# EAGLE design Blink_Schematic_v2 (EAGLE 9.1.3)
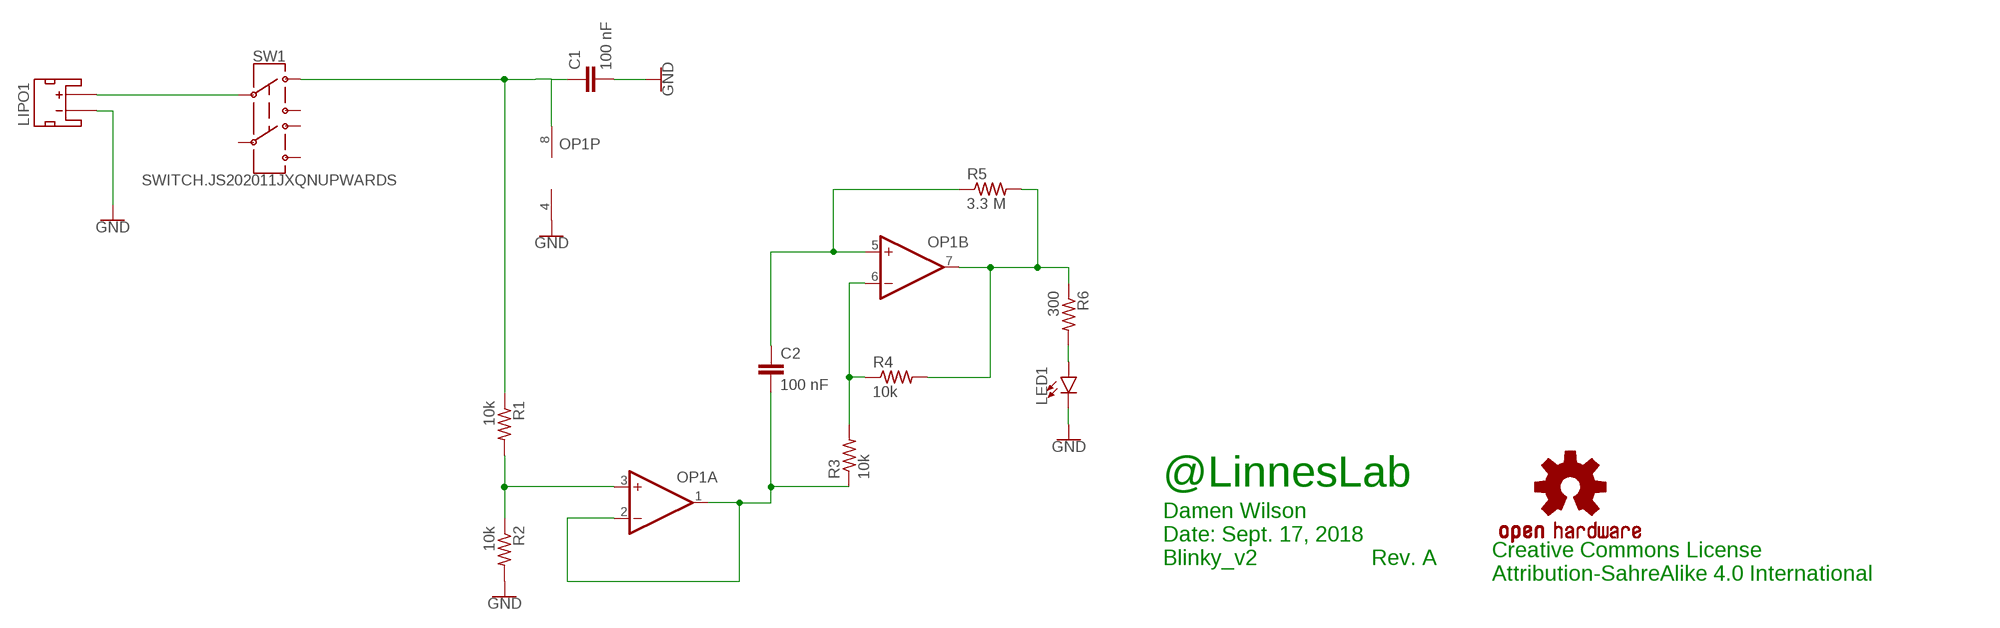
[diagram p0: schematic, sheet 1]

## Parts
C1  100 nF  C-EUC0402  [C0402]
C2  100 nF  C-EUC0402  [C0402]
LED1  LED0603  [LED-0603]
LIPO1  JST_2MM_MALE  [JST-2-SMD]
LOGO1  OSHW-LOGOL  [OSHW-LOGO-L]
OP1  OP-DUALRM  [MSOP08]
R1  10k  R-US_R0402  [R0402]
R2  10k  R-US_R0402  [R0402]
R3  10k  R-US_R0402  [R0402]
R4  10k  R-US_R0402  [R0402]
R5  3.3 M  R-US_R0402  [R0402]
R6  300  R-US_R0402  [R0402]
SW1  SWITCH.JS202011JXQNUPWARDS  [SWITCH.00]

## Nets
GND: C1.2 LED1.C LIPO1.1(-) OP1.4(P:V-) R2.2
N$1: LIPO1.2(+) SW1.2
N$2: C1.1 OP1.8(P:V+) R1.1 SW1.1
N$3: OP1.3(A:+IN) R1.2 R2.1
N$4: C2.2 OP1.1(A:OUT) OP1.2(A:-IN) R3.1
N$5: C2.1 OP1.5(B:+IN) R5.1
N$6: OP1.6(B:-IN) R3.2 R4.1
N$7: OP1.7(B:OUT) R4.2 R5.2 R6.1
N$8: LED1.A R6.2
Unconnected: LIPO1.NC1(PAD1) LIPO1.NC2(PAD2) SW1.3 SW1.5 SW1.6 SW1.7

## Notes on the sheet
- @LinnesLab
- Damen Wilson
  Date: Sept. 17, 2018
  Blinky_v2                   Rev. A
- Creative Commons License
  Attribution-SahreAlike 4.0 International

## Library data of the parts
C1 C2 = rcl:C-EU: CAPACITOR, European symbol; SPICEPREFIX: C
LED1 = CalvEngIO-LED:LED: LED (Generic) Standard schematic elements and footprints for 5mm, 3mm, 1206, and 0603 sized LEDs. Generic LEDs with no color specified. LTST-C190KGKT: arrow indicates cathode
LIPO1 = CalvEngIO-Connectors:JST_2MM_MALE: JST 2MM MALE RA CONNECTOR Two pin, compact surface mount connector. Commonly used as a battery input connection point. We really like the solid locking feeling and high current rating on these small connectors. We use these all the time as battery connectors. Mates to single-cell LiPo batteries. Here is the connector we sell at SparkFun: JST Right Angle Connector - White <https://www.sparkfun.com/products/8612> (PRT-08612) Datasheet <http://www.sparkfun.com/datasheets/Prototyping/Connectors/JST-Horizontal.pdf> It was used on these SparkFun products: SparkFun MOSFET Power Controller <https://www.sparkfun.com/products/11214> (PRT-11214) SparkFun Battery Babysitter - LiPo Battery Manager <https://www.sparkfun.com/products/13777> (PRT-13777) And many, many others that required a lipo battery connection.; PROD_ID: CONN-11443; SF_ID: PRT-08612
LOGO1 = CalvEngIO-Logos:OSHW-LOGO: Open-Source Hardware (OSHW) Logo This logo indicates the piece of hardware it is found on incorporates a OSHW license and/or adheres to the definition of open source hardware found here: http://freedomdefined.org/OSHW
OP1 = CalvEngIO-AnalogIC:OP-DUAL: Precision Micropower, Low Noise CMOS, Rail-to-Rail Input/Output Operational Amplifiers Source: http://www.analog.com/static/imported-files/data_sheets/AD8603_8607_8609.pdf; MF: ALTERA CORPORATION; MPN: AD8607ARMZ-REEL; OC_FARNELL: 1464990; OC_NEWARK: 59K6925
R1-R6 = adafruit:R-US_: RESISTOR, American symbol
SW1 = CalvEngIO-Switches:SWITCH.JS202011JXQN: Manufacturer's Part Numer: JS202011JAQN for right angle throw JS202011JCQN for top side throw

## Board
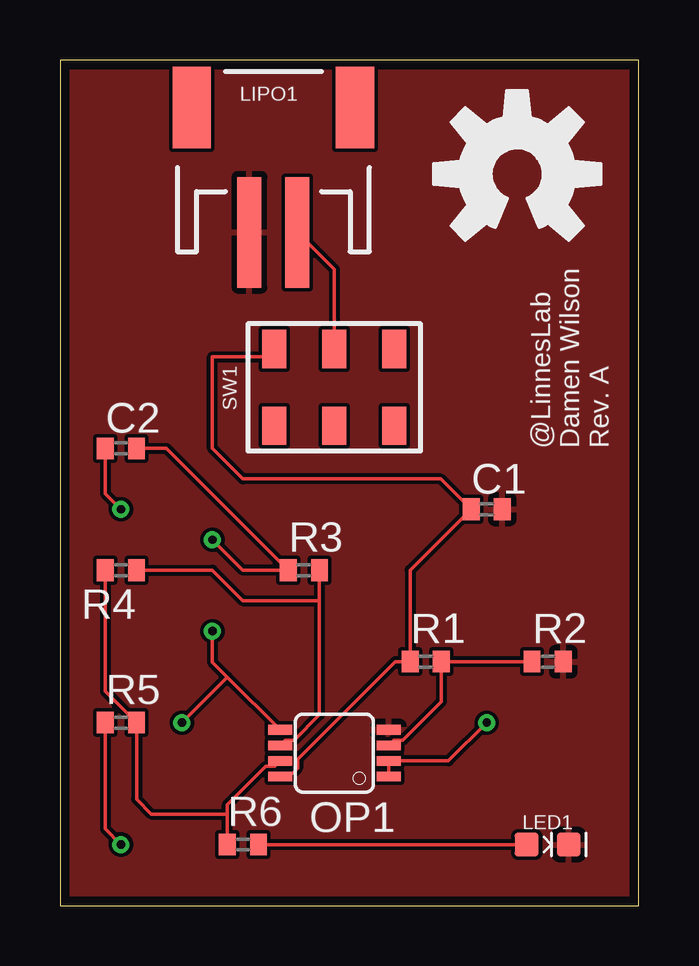
[diagram p1: board, top side]
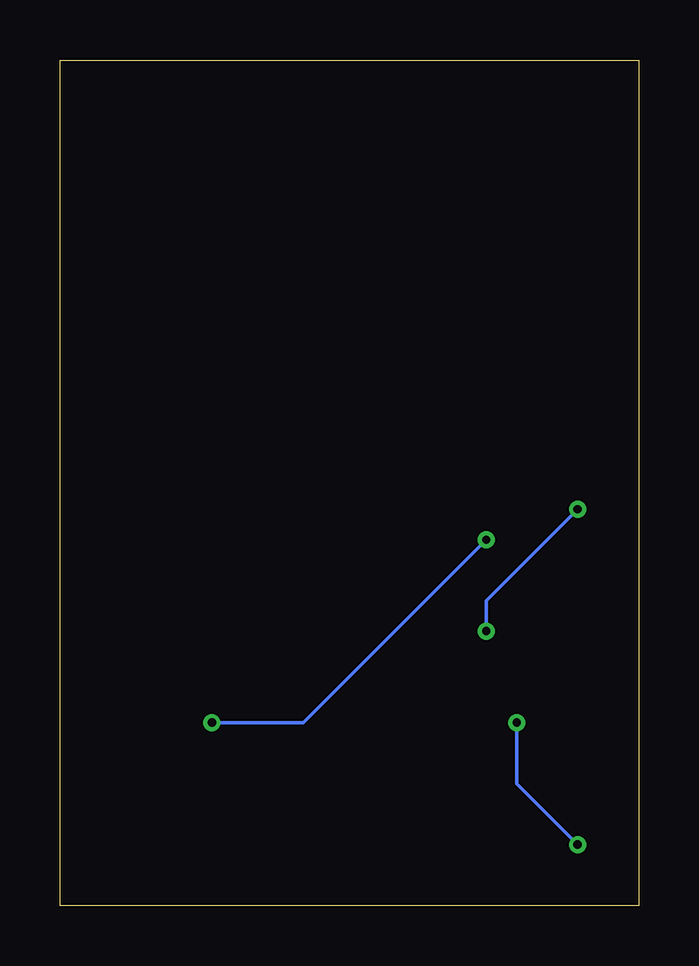
[diagram p2: board, bottom side, seen from below]

Size 24.11 x 35.23 mm. Coordinates in mm from the lower left corner, seen from the top.
Outline: 0,0 24.11,0 24.11,35.23 0,35.23 0,0
Copper layers (1*16): Top 0.0356mm / dielectric 1.5011mm / Bottom 0.0356mm
Design rules "LaenPCBOrder": minimum track width 6mil, minimum drill 13mil, track to track 6mil, track to pad 6mil, pad to pad 6mil, via to via 6mil, smd to smd 6mil, copper to edge 15mil, drill to drill 6mil, minimum pad ring 7mil, minimum via ring 7mil, stop-mask expansion 3mil, vias tented up to drill 0mil, thermal gap 10mil

### Footprints (pad centres in the part's own frame; a part is rotated, then mirrored left to right if it is on the bottom)
C0402 = smd 0.7 x 0.9: 1 -0.65,0; 2 0.65,0
LED-0603 = smd 1 x 1: A -0.877,0; C 0.877,0
JST-2-SMD = smd 1 x 4.6: 1 -1,-3.7; 2 1,-3.7 | smd 1.6 x 3.4: NC1 -3.4,1.5; NC2 3.4,1.5
MSOP08 = smd 0.4 x 1: 1 -0.976,-2.263; 2 -0.326,-2.263; 3 0.324,-2.263; 4 0.974,-2.263; 5 0.974,2.262; 6 0.324,2.262; 7 -0.326,2.262; 8 -0.976,2.262
R0402 = smd 0.7 x 0.9: 1 -0.65,0; 2 0.65,0
SWITCH.00 = smd 1 x 1.6: 1 -2.5,1.6; 2 0,1.6; 3 2.5,1.6; 5 -2.5,-1.6; 6 0,-1.6; 7 2.5,-1.6

### Placement (x,y rotation side)
C1  17.78,16.51 0 top
C2  2.54,19.05 0 top
LED1  20.32,2.54 0 top
LIPO1  8.89,31.75 0 top
LOGO1  19.05,30.48 0 top
OP1  11.43,6.35 90 top
R1  15.24,10.16 0 top
R2  20.32,10.16 0 top
R3  10.16,13.97 0 top
R4  2.54,13.97 180 top
R5  2.54,7.62 0 top
R6  7.62,2.54 0 top
SW1  11.43,21.59 0 top

### Tracks (layer width: path | path; a pad name or v marks a point on that pad's centre or on a via)
GND
  pour Top: -2.54,36.83 -2.54,-1.27 25.4,-1.27 25.4,36.83
N$1
  Top 0.152: LIPO1.2 11.43,26.51 SW1.2
N$2
  Top 0.152: OP1.8 9.54,5.37 9.9,5.73 9.9,6.09 13.97,10.16 R1.1 14.59,13.97 C1.1 15.86,17.78 7.62,17.78 6.35,19.05 6.35,22.86 8.6,22.86 SW1.1
N$3
  Top 0.152: R2.1 R1.2 15.89,8.5 14.29,6.89 13.91,6.89 OP1.3
N$4  (via drill 0.35)
  Top 0.152: C2.2 4.43,19.05 R3.1 7.62,13.97 v6.35,15.24 | v17.78,7.62 16.18,6.02 OP1.2 OP1.1
  Bottom 0.152: v6.35,15.24 13.97,7.62 v17.78,7.62
N$5  (via drill 0.35)
  Top 0.152: C2.1 1.89,17.16 v2.54,16.51 | v6.35,11.43 6.35,10.14 6.98,9.52 | 6.98,9.52 OP1.5 | R5.1 1.89,3.19 v2.54,2.54 | v5.08,7.62 6.98,9.52
  Bottom 0.152: v2.54,16.51 6.35,12.7 v6.35,11.43 | v2.54,2.54 5.08,5.08 v5.08,7.62
N$6
  Top 0.152: OP1.6 9.39,6.89 9.76,6.89 10.81,7.94 10.81,12.7 | R3.2 10.81,12.7 | R4.1 6.35,13.97 7.62,12.7 10.81,12.7
N$7
  Top 0.152: OP1.7 8.95,5.8 8.57,5.8 6.97,4.2 6.97,3.81 | R6.1 6.97,3.81 | 6.97,3.81 3.81,3.81 3.19,4.43 R5.2 1.89,8.92 R4.2
N$8
  Top 0.152: LED1.A R6.2

### Text on the board
tPlace: @LinnesLab / Damen Wilson / Rev. A